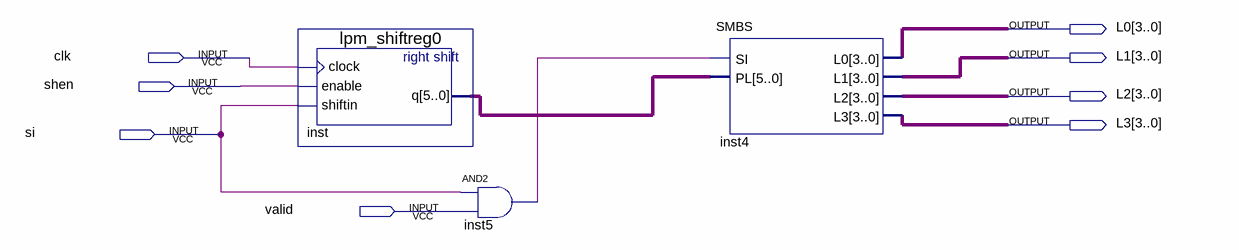
[diagram p0: schematic sheet]
// Quartus schematic DATApath2.bdf as structural Verilog: 3 symbols, 8 pins
module DATApath2 (
  input  clk,
  input  shen,
  input  si,
  input  valid,
  output [3:0] L0,
  output [3:0] L1,
  output [3:0] L2,
  output [3:0] L3
);

  wire inst5_out;
  wire [5:0] inst_q;

  lpm_shiftreg0 inst (.clock(clk), .enable(shen), .shiftin(si), .q(inst_q));
  and inst5 (inst5_out, si, valid);
  SMBS inst4 (.SI(inst5_out), .PL(inst_q), .L0(L0), .L1(L1), .L2(L2), .L3(L3));
endmodule
